# EAGLE design untitled (EAGLE 9.6.1)
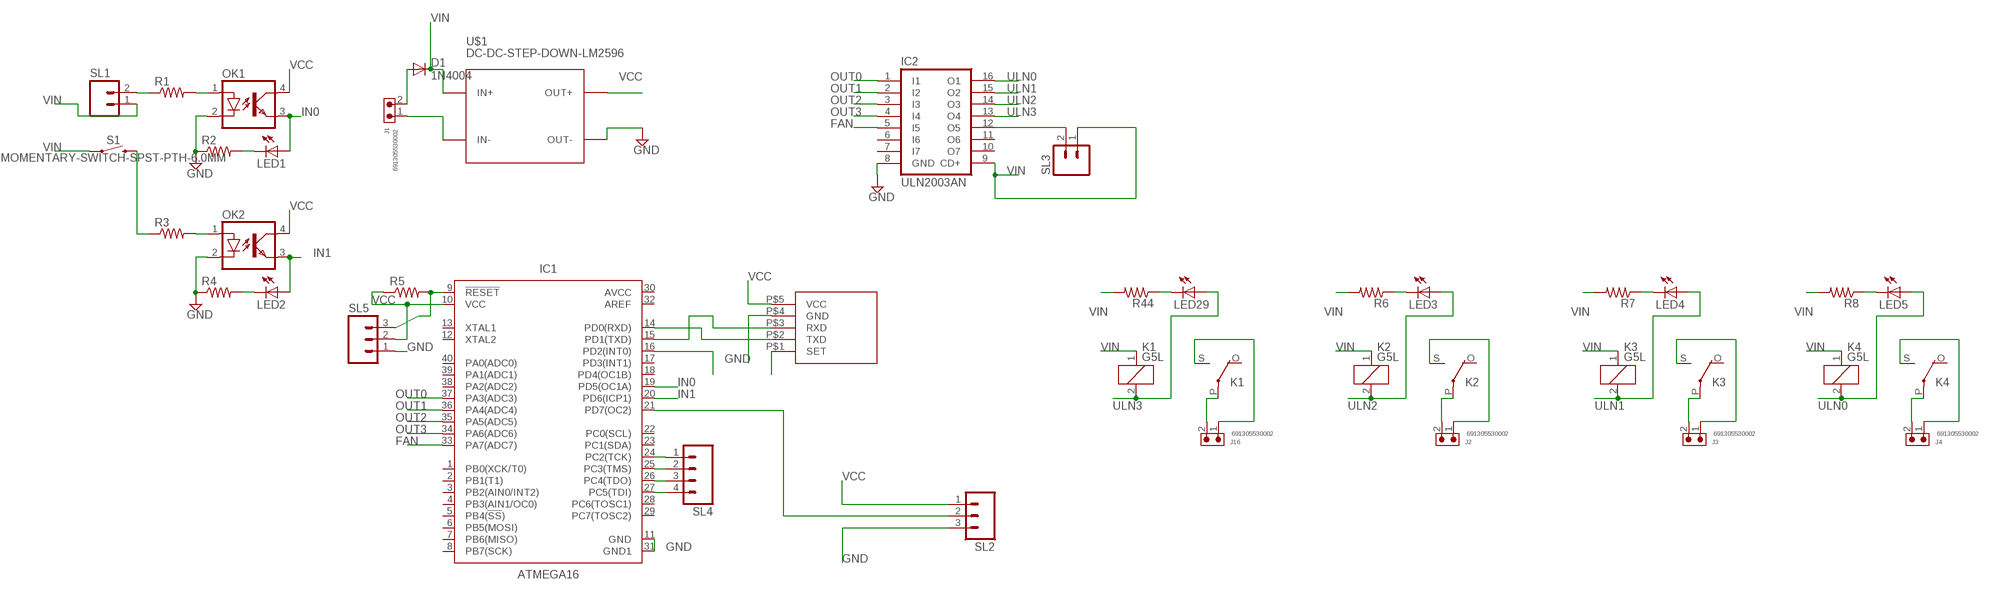
[diagram p0: schematic, sheet 1]

## Parts
D1  1N4004  [DO41-10]
IC1  ATMEGA16  ATMEGA32-16PU_DIP  [DIP1587W56P254L5229H482Q40B]
IC2  ULN2003AN  [DIL16]
J1  691305530002  691305530002  [691305530002]
J2  691305530002  691305530002  [691305530002]
J3  691305530002  691305530002  [691305530002]
J4  691305530002  691305530002  [691305530002]
J16  691305530002  691305530002  [691305530002]
K1  G5L  [G5LE]
K2  G5L  [G5LE]
K3  G5L  [G5LE]
K4  G5L  [G5LE]
LED1  LED5MM  [LED5MM]
LED2  LED5MM  [LED5MM]
LED3  LED5MM  [LED5MM]
LED4  LED5MM  [LED5MM]
LED5  LED5MM  [LED5MM]
LED29  LED5MM  [LED5MM]
OK1  PC817  [DIL04]
OK2  PC817  [DIL04]
R1  R-US_0207/7  [0207/7]
R2  R-US_0207/7  [0207/7]
R3  R-US_0207/7  [0207/7]
R4  R-US_0207/7  [0207/7]
R5  R-US_0207/7  [0207/7]
R6  R-US_0207/7  [0207/7]
R7  R-US_0207/7  [0207/7]
R8  R-US_0207/7  [0207/7]
R44  R-US_0207/7  [0207/7]
S1  MOMENTARY-SWITCH-SPST-PTH-6.0MM  [TACTILE_SWITCH_PTH_6.0MM]
SL1  M02  [02P]
SL2  M03  [03P]
SL3  M02  [02P]
SL4  M04  [04P]
SL5  M03  [03P]
U$1  DC-DC-STEP-DOWN-LM2596  [DC-DC-STEP-DOWN-LM2596]
U$2  HC12  [HC12]

## Nets
FAN: IC1.33(PA7(ADC7)) IC2.5(I5)
GND: IC1.11(GND) IC1.31(GND1) IC2.8(GND) OK1.2(C) OK2.2(C) R2.1 R4.1 SL2.3 SL5.1 U$1.OUT- U$2.P$4(GND)
IN0: IC1.19(PD5(OC1A)) LED1.A OK1.3(EMIT)
IN1: IC1.20(PD6(ICP1)) LED2.A OK2.3(EMIT)
N$1: D1.A J1.2
N$2: R1.1 SL1.2
N$3: OK1.1(A) R1.2
N$4: J2.2 K2.P(2:P)
N$5: IC1.9(!RESET!) R5.2 SL5.3
N$6: LED1.K(C) R2.2
N$7: R3.1 S1.3
N$8: OK2.1(A) R3.2
N$9: J2.1 K2.S(2:S)
N$10: LED3.K(C) R6.1
N$11: LED2.K(C) R4.2
N$12: J3.2 K3.P(2:P)
N$13: J3.1 K3.S(2:S)
N$14: LED4.K(C) R7.1
N$15: J4.2 K4.P(2:P)
N$16: J4.1 K4.S(2:S)
N$17: LED5.K(C) R8.1
N$18: IC1.14(PD0(RXD)) U$2.P$2(TXD)
N$19: IC1.15(PD1(TXD)) U$2.P$3(RXD)
N$20: IC1.16(PD2(INT0))
N$21: IC1.21(PD7(OC2)) SL2.2
N$22: IC2.12(O5) SL3.2
N$23: IC1.24(PC2(TCK)) SL4.1
N$24: J1.1 U$1.IN-
N$25: IC1.25(PC3(TMS)) SL4.2
N$26: IC1.26(PC4(TDO)) SL4.3
N$27: IC1.27(PC5(TDI)) SL4.4
N$28: U$2.P$1(SET)
N$75: J16.2 K1.P(2:P)
N$76: J16.1 K1.S(2:S)
N$77: LED29.K(C) R44.1
OUT0: IC1.37(PA3(ADC3)) IC2.1(I1)
OUT1: IC1.36(PA4(ADC4)) IC2.2(I2)
OUT2: IC1.35(PA5(ADC5)) IC2.3(I3)
OUT3: IC1.34(PA6(ADC6)) IC2.4(I4)
ULN0: IC2.16(O1) K4.2 LED5.A
ULN1: IC2.15(O2) K3.2 LED4.A
ULN2: IC2.14(O3) K2.2 LED3.A
ULN3: IC2.13(O4) K1.2 LED29.A
VCC: IC1.10(VCC) OK1.4(COL) OK2.4(COL) R5.1 SL2.1 SL5.2 U$1.OUT+ U$2.P$5(VCC)
VIN: D1.C IC2.9(CD+) K1.1 K2.1 K3.1 K4.1 R6.2 R7.2 R8.2 R44.2 S1.1 SL1.1 SL3.1 U$1.IN+
Unconnected: IC1.1(PB0(XCK/T0)) IC1.2(PB1(T1)) IC1.3(PB2(AIN0/INT2)) IC1.4(PB3(AIN1/OC0)) IC1.5(PB4(!SS!)) IC1.6(PB5(MOSI)) IC1.7(PB6(MISO)) IC1.8(PB7(SCK)) IC1.12(XTAL2) IC1.13(XTAL1) IC1.17(PD3(INT1)) IC1.18(PD4(OC1B)) IC1.22(PC0(SCL)) IC1.23(PC1(SDA)) IC1.28(PC6(TOSC1)) IC1.29(PC7(TOSC2)) IC1.32(AREF) IC1.38(PA2(ADC2)) IC1.39(PA1(ADC1)) IC1.40(PA0(ADC0)) IC2.6(I6) IC2.7(I7) IC2.10(O7) IC2.11(O6) K1.O(2:O) K2.O(2:O) K3.O(2:O) K4.O(2:O)

## Power pins joined to a net without a drawn wire
AVCC: IC1.30(AVCC)

## Library data of the parts
D1 = adafruit:1N4004: DIODE General purpose 1N400x type rectifier (With bigger pads) http://www.ladyada.net/library/pcb/eaglelibrary.html
IC1 = IC_Embedded:ATMEGA32*DIP: 8-bit Microcontroller with 32KBytes In-System Programmable Flash Datasheet <http://ww1.microchip.com/downloads/en/DeviceDoc/doc2503.pdf>; CATEGORY: IC_Embedded; DESCRIPTION: IC MCU 8BIT 32KB FLASH 40DIP; MANUFACTURER: Microchip Technology; MPN: ATMEGA32-16PU; OPERATING_TEMP: -40°C to 85°C; PART_STATUS: Active; SERIES: AVR® ATmega; SPEED: 16MHz; SUB-CATEGORY: Microcontroller
IC2 = uln-udn:ULN2003A: DRIVER ARRAY
J1-J4 J16 = Wurth_Connectors_WR-TBL Pluggable Connector:691305530002: WR-TBL Serie 3055 - 5,08 mm - PCB Header Vertical Entry with Plastic Latches KIND PROPERTIES Pitch 5.08 mm MATERIAL PROPERTIES Insulator Material PA66 Insulator Flammability Rating UL94 V-0 Insulator Color Green Terminal Material Copper Alloy Terminal Plating Tin-plated surface GENERAL INFORMATION Operating Temperature -40 up to +105 °C ELECTRICAL PROPERTIES IR UL 16 A Working Voltage [UL] 300 V (AC) Withstanding Voltage [UL] 2500 V (AC) Contact Resistance [UL] 20 mΩ CERTIFICATION UL Approval E315414 <https://www.we-online.com/catalog/media/o135349v209%20Family_WR-TBL3_6913055300xx.jpg> Details see: https://www.we-online.com/catalog/en/TBL_5_08_3055_6913055300XX/ Updated by Ella Wu 2019-12-30 2019(C) Wurth Elektronik; DATASHEET-URL: https://www.we-online.com/catalog/datasheet/691305530002.pdf; IR-UL: 16A; MOUNT: THT; PART-NUMBER: 691305530002; PINS: 2; PITCH: 5.08mm; TYPE: Vertical; WORKING-VOLTAGE-UL: 300V (AC)
K1-K4 = relay:G5L: RELAY 1 x switch, 10 A/120 V AC, 8 A/30 V ADC, Omron; OC_FARNELL: unknown; OC_NEWARK: unknown
LED1-LED5 LED29 = adafruit:LED: LED OSRAM: - CHIPLED LG R971, LG N971, LY N971, LG Q971, LY Q971, LO R971, LY R971 LH N974, LH R974 LS Q976, LO Q976, LY Q976 LO Q996 - Hyper CHIPLED LW Q18S LB Q993, LB Q99A, LB R99A - SideLED LS A670, LO A670, LY A670, LG A670, LP A670 LB A673, LV A673, LT A673, LW A673 LH A674 LY A675 LS A676, LA A676, LO A676, LY A676, LW A676 LS A679, LY A679, LG A679 - Hyper Micro SIDELED® LS Y876, LA Y876, LO Y876, LY Y876 LT Y87S - SmartLED LW L88C, LW L88S LB L89C, LB L89S, LG L890 LS L89K, LO L89K, LY L89K LS L896, LA L896, LO L896, LY L896 - TOPLED LS T670, LO T670, LY T670, LG T670, LP T670 LSG T670, LSP T670, LSY T670, LOP T670, LYG T670 LG T671, LOG T671, LSG T671 LB T673, LV T673, LT T673, LW T673 LH T674 LS T676, LA T676, LO T676, LY T676, LB T676, LH T676, LSB T676, LW T676 LB T67C, LV T67C, LT T67C, LS T67K, LO T67K, LY T67K, LW E67C LS E67B, LA E67B, LO E67B, LY E67B, LB E67C, LV E67C, LT E67C LW T67C LS T679, LY T679, LG T679 LS T770, LO T770, LY T770, LG T770, LP T770 LB T773, LV T773, LT T773, LW T773 LH T774 LS E675, LA E675, LY E675, LS T675 LS T776, LA T776, LO T776, LY T776, LB T776 LHGB T686 LT T68C, LB T68C - Hyper Mini TOPLED® LB M676 - Mini TOPLED Santana® LG M470 LS M47K, LO M47K, LY M47K Source: http://www.osram.convergy.de/
OK1 OK2 = optocoupler:PC817: SHARP OPTO COUPLER; MPN: PC817X4J000F; OC_FARNELL: 9707727; OC_NEWARK: 97K7059
R1-R8 R44 = adafruit:R-US_: RESISTOR, American symbol
S1 = SparkFun-Switches:MOMENTARY-SWITCH-SPST: Momentary Switch (Pushbutton) - SPST Normally-open (NO) SPST momentary switches (buttons, pushbuttons). Variants PTH-12MM - 12mm square, through-hole Momentary Pushbutton Switch - 12mm Square <https://www.sparkfun.com/products/9190> (COM-09190) PTH-6.0MM, PTH-6.0MM-KIT - 6.0mm square, through-hole Mini Pushbutton Switch <https://www.sparkfun.com/products/97> (COM-00097) KIT package intended for soldering kit's - only one side of pads' copper is exposed. PTH-RIGHT-ANGLE-KIT - Right-angle, through-hole Right Angle Tactile Button <https://www.sparkfun.com/products/10791> - Used on SparkFun BigTime Watch Kit <https://www.sparkfun.com/products/11734> SMD-12MM - 12mm square, surface-mount Tactile Button - SMD (12mm) <https://www.sparkfun.com/products/12993> (COM-12993) Used on SparkFun PicoBoard <https://www.sparkfun.com/products/11888> SMD-4.5MM - 4.5mm Square Trackball Switch Used on SparkFun Blackberry Trackballer Breakout <https://www.sparkfun.com/products/13169> SMD-4.6MMX2.8MM - 4.60mm x 2.80mm, surface mount Used on SparkFun SAMD21 Mini Breakout <https://www.sparkfun.com/products/13664> SMD-5.2MM, SMD-5.2-REDUNDANT - 5.2mm square, surface-mount Mini Pushbutton Switch - SMD <https://www.sparkfun.com/products/8720> (COM-08720) Used on Arduino Pro Mini <https://www.sparkfun.com/products/11114> REDUNDANT package connects both switch circuits together SMD-6.0X3.5MM - 6.0 x 3.5mm, surface mount Momentary Reset Switch SMD <https://www.sparkfun.com/products/8229> (COM-08229) SMD-6.2MM-TALL - 6.2mm square, surface mount Tactile Button - SMD (6mm) <https://www.sparkfun.com/products/12992> Used on SparkFun Digital Sandbox <https://www.sparkfun.com/products/12651> SMD-RIGHT-ANGLE - Right-angle, surface mount Used on SparkFun Block for Intel® Edison - Arduino <https://www.sparkfun.com/products/13036>; PROD_ID: SWCH-08441; SF_SKU: COM-00097
SL1 SL3 = con-amp-quick:M02: AMP QUICK CONNECTOR; OC_FARNELL: unknown; OC_NEWARK: unknown
SL2 SL5 = con-amp-quick:M03: AMP QUICK CONNECTOR; OC_FARNELL: unknown; OC_NEWARK: unknown
SL4 = con-amp-quick:M04: AMP QUICK CONNECTOR; OC_FARNELL: unknown; OC_NEWARK: unknown
U$1 = diy-modules:DC-DC-STEP-DOWN-LM2596: DC/DC Step-Down Regulator based on LM2596-ADJ chip LM2596 datasheet available here: http://www.ti.com/lit/ds/symlink/lm2596.pdf Click here to find device on ebay.com <http://www.ebay.com/sch/lm2596+power+regulator>
U$2 = techart:HC12

## Board
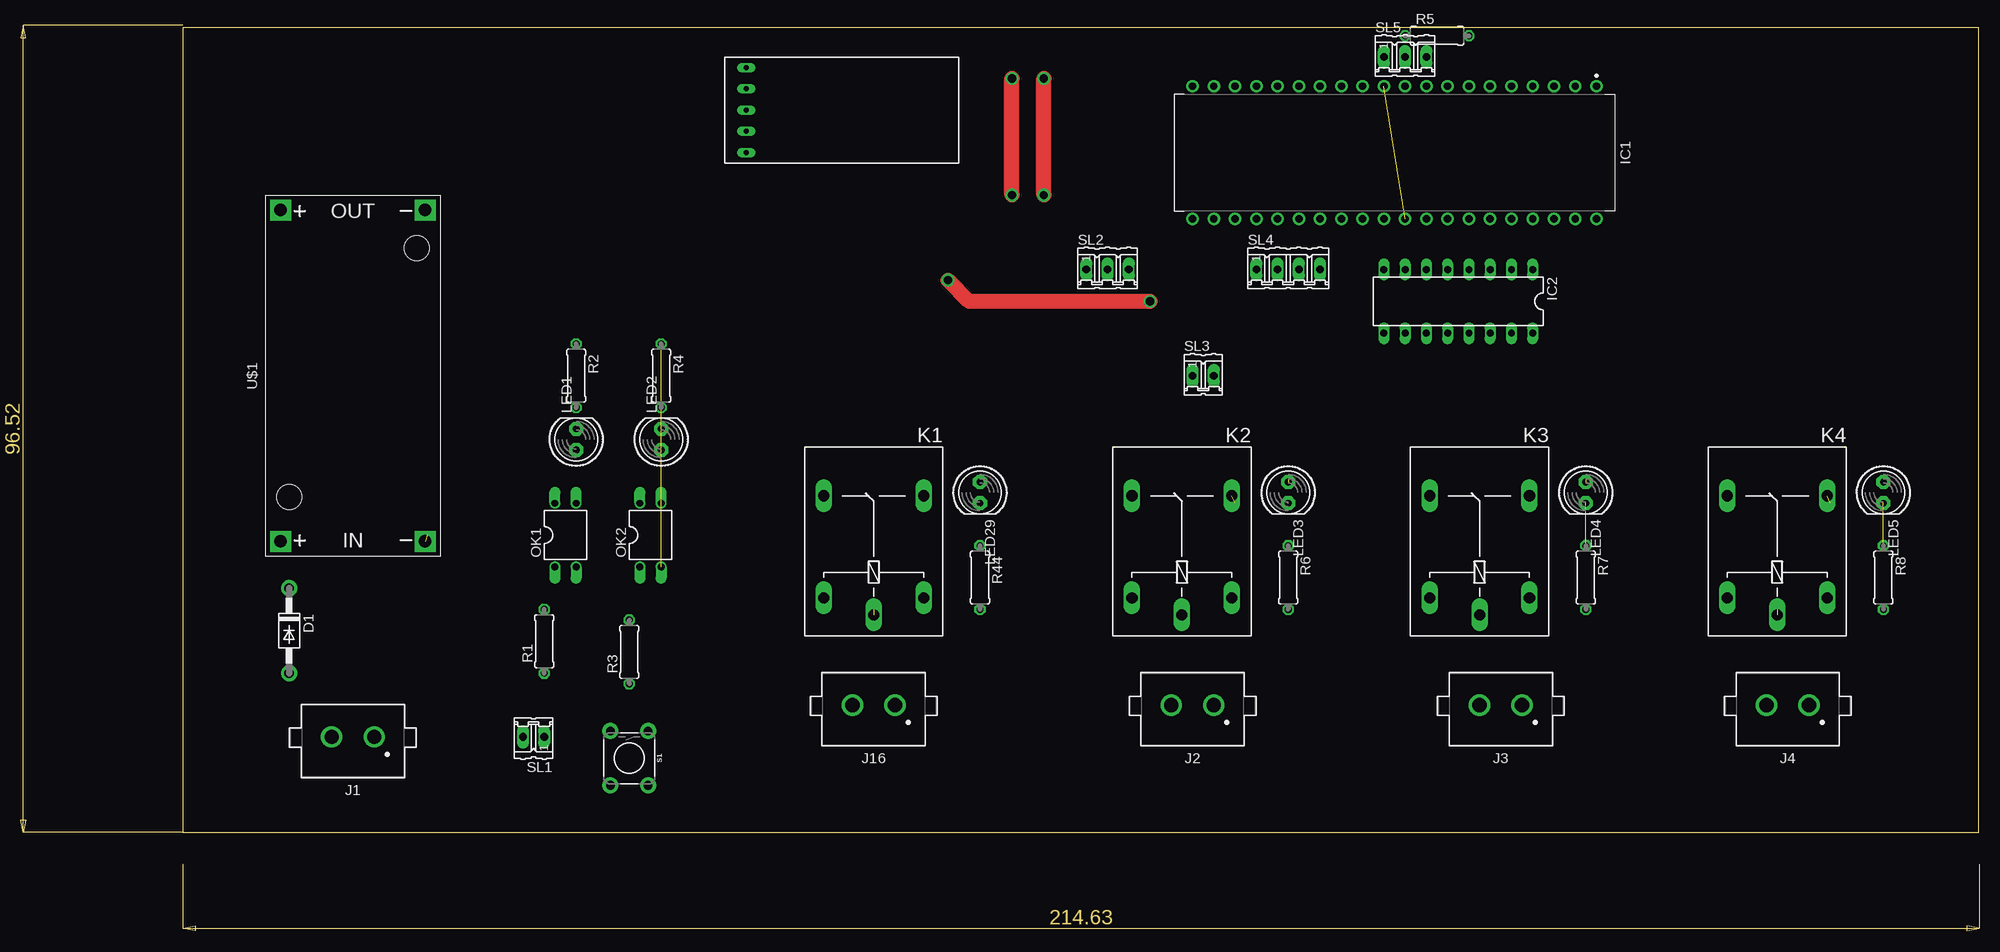
[diagram p1: board, top side]
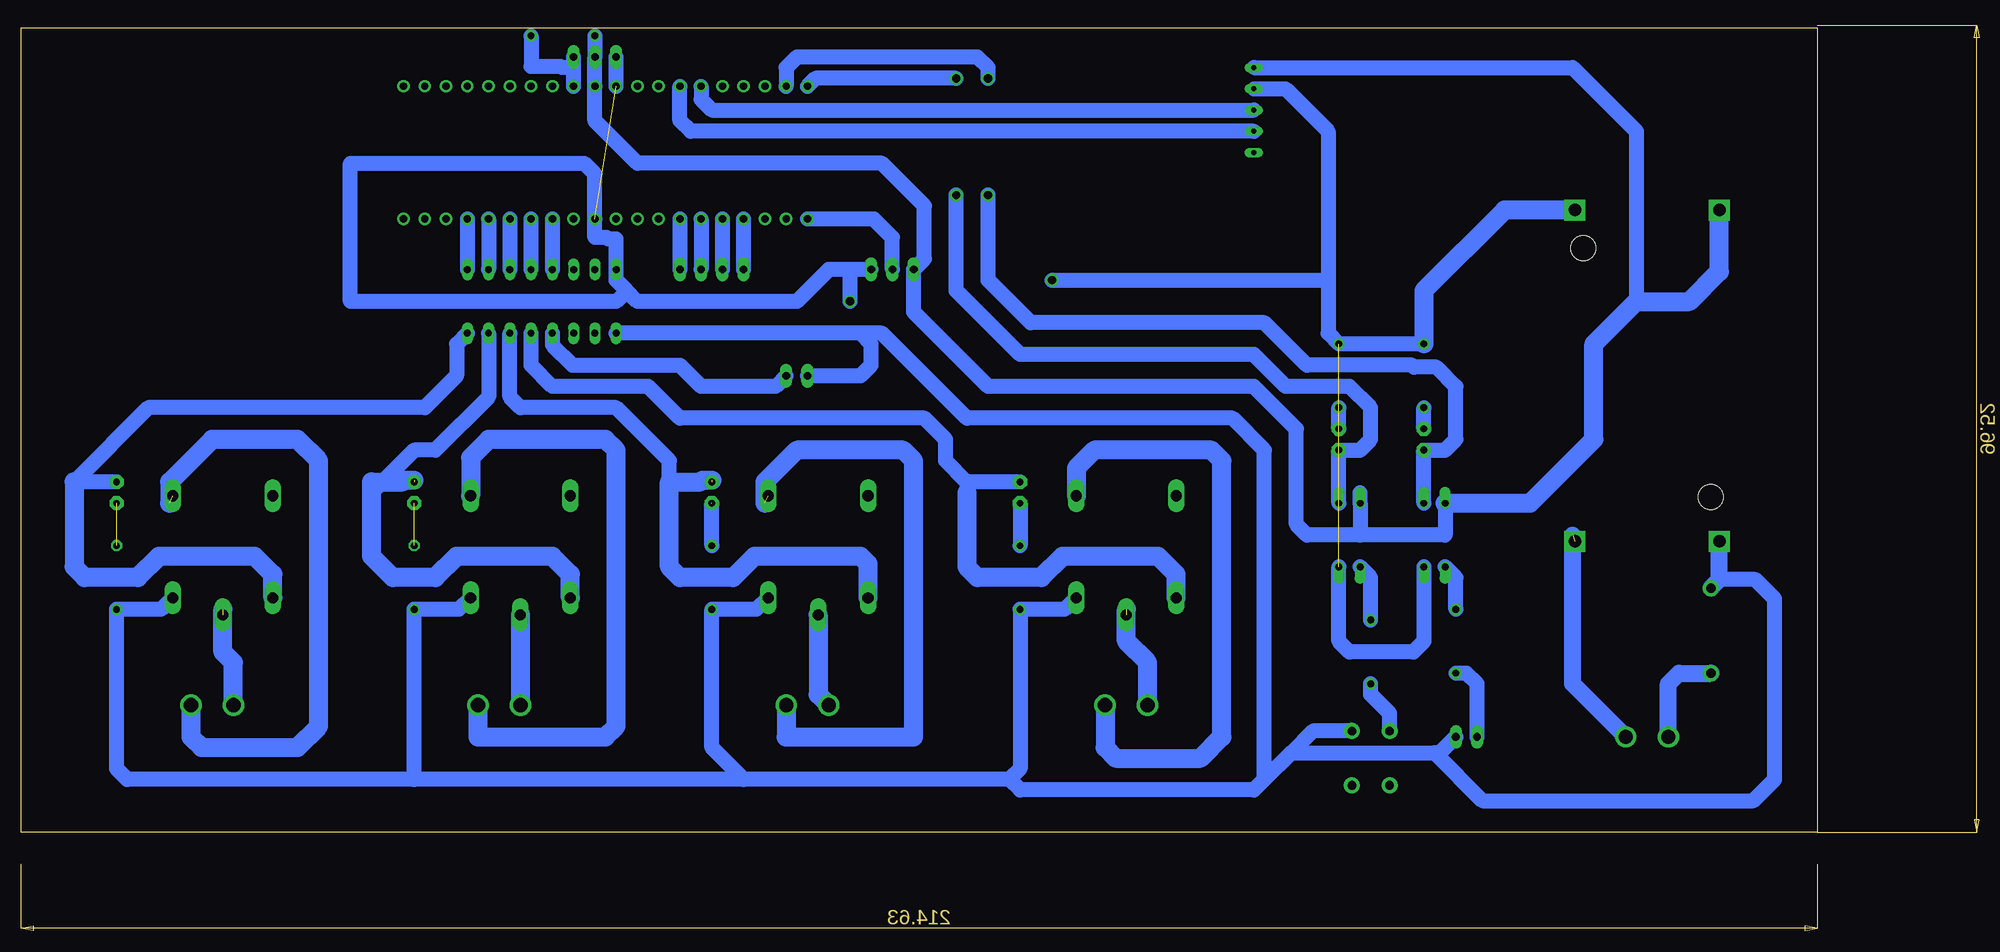
[diagram p2: board, bottom side, seen from below]

Size 214.61 x 96.19 mm. Coordinates in mm from the lower left corner, seen from the top.
Outline: 0,0 214.61,0 214.61,96.19 0,96.19 0,0
Copper layers (1*16): Top 0.035mm / dielectric 1.5mm / Bottom 0.035mm
Design rules "default *": minimum track width 30mil, minimum drill 0.35mm, track to track 30mil, track to pad 30mil, pad to pad 30mil, via to via 30mil, smd to smd 6mil, copper to edge 40mil, drill to drill 6mil, minimum pad ring 10mil, minimum via ring 8mil, stop-mask expansion 4mil, vias tented up to drill 0mil, thermal gap 10mil

### Footprints (pad centres in the part's own frame; a part is rotated, then mirrored left to right if it is on the bottom)
DO41-10 = drill 1.118 pad 1.93: A 5.08,0; C -5.08,0
DIP1587W56P254L5229H482Q40B = drill 0.877 pad 1.477: 1 -7.938,24.13; 2 -7.938,21.59; 3 -7.938,19.05; 4 -7.938,16.51; 5 -7.938,13.97; 6 -7.938,11.43; 7 -7.938,8.89; 8 -7.938,6.35; 9 -7.938,3.81; 10 -7.938,1.27; 11 -7.938,-1.27; 12 -7.938,-3.81; 13 -7.938,-6.35; 14 -7.938,-8.89; 15 -7.938,-11.43; 16 -7.938,-13.97; 17 -7.938,-16.51; 18 -7.938,-19.05; 19 -7.938,-21.59; 20 -7.938,-24.13; 21 7.938,-24.13; 22 7.938,-21.59; 23 7.938,-19.05; 24 7.938,-16.51; 25 7.938,-13.97; 26 7.938,-11.43; 27 7.938,-8.89; 28 7.938,-6.35; 29 7.938,-3.81; 30 7.938,-1.27; 31 7.938,1.27; 32 7.938,3.81; 33 7.938,6.35; 34 7.938,8.89; 35 7.938,11.43; 36 7.938,13.97; 37 7.938,16.51; 38 7.938,19.05; 39 7.938,21.59; 40 7.938,24.13
DIL16 = drill 0.813 long: 1 -8.89,-3.81; 2 -6.35,-3.81; 3 -3.81,-3.81; 4 -1.27,-3.81; 5 1.27,-3.81; 6 3.81,-3.81; 7 6.35,-3.81; 8 8.89,-3.81; 9 8.89,3.81; 10 6.35,3.81; 11 3.81,3.81; 12 1.27,3.81; 13 -1.27,3.81; 14 -3.81,3.81; 15 -6.35,3.81; 16 -8.89,3.81
691305530002 = drill 1.7: 1 -2.54,0; 2 2.54,0
G5LE = drill 1.321 long: 1 -7.493,-5.969; 2 -7.493,5.969; O 4.699,5.969; P -9.525,0; S 4.699,-5.969
LED5MM = drill 0.813 pad 1.676 octagon: A -1.27,0; K 1.27,0
DIL04 = drill 0.813 offset: 1 -1.27,-3.81; 2 1.27,-3.81; 3 1.27,3.81; 4 -1.27,3.81
0207/7 = drill 0.813 octagon: 1 -3.81,0; 2 3.81,0
TACTILE_SWITCH_PTH_6.0MM = drill 1.016 pad 1.88: 1 -3.251,2.261; 2 3.251,2.261; 3 -3.251,-2.261; 4 3.251,-2.261
02P = drill 0.914 long: 1 -1.27,0; 2 1.27,0
03P = drill 0.914 long: 1 -2.54,0; 2 0,0; 3 2.54,0
04P = drill 0.914 long: 1 -3.81,0; 2 -1.27,0; 3 1.27,0; 4 3.81,0
DC-DC-STEP-DOWN-LM2596 = drill 1.5 pad 2.5 square: IN+ -19.812,8.636; IN- -19.812,-8.636; OUT+ 19.812,8.636; OUT- 19.812,-8.636 | hole 3: -14.478,7.62; 15.24,-7.62
HC12 = drill 0.6 long: P$1 5.08,5.08; P$2 5.08,2.54; P$3 5.08,0; P$4 5.08,-2.54; P$5 5.08,-5.08

### Placement (x,y rotation side)
D1  12.7,24.13 270 top
IC1  144.78,81.28 270 top
IC2  152.4,63.5 180 top
J1  20.32,11.43 180 top
J2  120.65,15.24 180 top
J3  157.48,15.24 180 top
J4  191.77,15.24 180 top
J16  82.55,15.24 180 top
K1  82.55,35.56 90 top
K2  119.38,35.56 90 top
K3  154.94,35.56 90 top
K4  190.5,35.56 90 top
LED1  46.99,46.99 90 top
LED2  57.15,46.99 90 top
LED3  132.08,40.64 270 top
LED4  167.64,40.64 270 top
LED5  203.2,40.64 270 top
LED29  95.25,40.64 270 top
OK1  45.72,35.56 0 top
OK2  55.88,35.56 0 top
R1  43.18,22.86 90 top
R2  46.99,54.61 270 top
R3  53.34,21.59 90 top
R4  57.15,54.61 270 top
R5  149.86,95.25 0 top
R6  132.08,30.48 270 top
R7  167.64,30.48 270 top
R8  203.2,30.48 270 top
R44  95.25,30.48 270 top
S1  53.34,8.89 270 top
SL1  41.91,11.43 180 top
SL2  110.49,67.31 0 top
SL3  121.92,54.61 0 top
SL4  132.08,67.31 0 top
SL5  146.05,92.71 0 top
U$1  20.32,54.61 90 top
U$2  72.39,86.36 180 top

### Tracks (layer width: path | path; a pad name or v marks a point on that pad's centre or on a via)
FAN
  Bottom 1.778: IC1.33 IC2.5
GND  (via drill 1)  (2 unrouted)
  Top 1.778: v115.57,63.5 93.98,63.5 v91.44,66.04
  Bottom 1.778: OK1.2 46.99,22.86 48.26,21.59 55.88,21.59 57.15,22.86 OK2.2 | R2.1 R4.1 58.42,59.69 58.42,66.04 | IC1.11 SL5.1 | SL2.3 115.57,67.31 | 115.57,67.31 118.11,67.31 121.92,63.5 140.97,63.5 142.24,64.77 | 142.24,64.77 143.51,66.04 IC2.8 143.51,70.95 144.5,70.95 144.67,71.12 146.05,71.12 IC1.31 146.05,78.74 147.32,80.01 175.26,80.01 175.26,63.5 143.51,63.5 142.24,64.77 | U$2.P$4 63.5,88.9 58.42,83.82 58.42,66.04 | 115.57,67.31 v115.57,63.5 | v91.44,66.04 58.42,66.04
  Bottom 2.286: U$1.OUT- 37.34,74.42 46.99,64.77 R2.1
IN0  (via drill 1)
  Top 1.778: v99.06,76.2 v99.06,90.17
  Bottom 1.778: OK1.3 LED1.A 44.45,45.72 43.18,46.99 43.18,53.34 45.47,55.63 48.15,55.63 48.4,55.88 60.96,55.88 66.04,60.96 93.98,60.96 99.06,66.04 v99.06,76.2 | v99.06,90.17 99.06,91.44 100.33,92.71 121.92,92.71 123.19,91.44 IC1.19
IN1  (via drill 1)
  Top 1.778: v102.87,76.2 v102.87,90.17
  Bottom 1.778: OK2.3 LED2.A 54.61,45.72 53.34,46.99 53.34,50.8 55.88,53.34 63.5,53.34 67.31,57.15 95.25,57.15 102.87,64.77 v102.87,76.2 | v102.87,90.17 119.7,90.17 IC1.20
N$1
  Bottom 2.032: J1.2 17.78,17.78 16.51,19.05 D1.A
N$2
  Bottom 1.778: SL1.2 40.64,17.78 41.91,19.05 R1.1
N$3
  Bottom 1.778: R1.2 43.18,30.48 OK1.1
N$4
  Bottom 2.286: K2.P 119.38,16.51 J2.2
N$5
  Bottom 1.778: IC1.9 148.59,91.44 | 148.59,91.44 SL5.3 | 148.59,91.44 149.97,91.44 150.14,91.61 153.67,91.61 R5.2
N$6
  Bottom 1.778: LED1.K R2.2
N$7
  Bottom 1.778: S1.3 51.08,14.25 53.34,16.51 R3.1
N$8
  Bottom 1.778: R3.2 53.34,30.48 OK2.1
N$9  (1 unrouted)
  Bottom 2.286: J2.1 123.19,11.43 107.95,11.43 107.95,44.45 109.22,45.72 121.92,45.72 125.73,41.91 125.73,39.37
N$10  (1 unrouted)
  Bottom 1.778: R6.1 132.08,39.3 132.06,39.32
N$11
  Bottom 1.778: LED2.K R4.2
N$12
  Bottom 2.286: K3.P J3.2
N$13
  Bottom 2.286: J3.1 160.02,11.43 144.78,11.43 143.51,12.7 143.51,45.72 144.78,46.99 158.75,46.99 160.91,44.83 K3.S
N$14  (1 unrouted)
N$15  (1 unrouted)
  Bottom 2.286: J4.2 189.23,20.32 190.5,21.59 190.5,26.67
N$16  (1 unrouted)
  Bottom 2.286: J4.1 194.31,11.43 193.04,10.16 181.61,10.16 179.07,12.7 179.07,44.45 181.61,46.99 191.77,46.99 196.85,41.91 196.85,39.37
N$17  (1 unrouted)
N$18
  Bottom 1.778: U$2.P$2 134.62,83.82 135.89,85.09 IC1.14
N$19
  Bottom 1.778: IC1.15 133.35,87.63 132.08,86.36 U$2.P$3
N$21
  Bottom 1.778: SL2.2 110.49,71.12 112.71,73.34 IC1.21
N$22
  Bottom 1.778: IC2.12 151.13,58.3 148.71,55.88 135.89,55.88 133.35,53.34 124.46,53.34 SL3.2
N$23
  Bottom 1.778: SL4.1 IC1.24
N$24  (1 unrouted)
  Bottom 2.032: J1.1 29.21,17.78 29.21,35.56
N$25
  Bottom 1.778: IC1.25 SL4.2
N$26
  Bottom 1.778: IC1.26 SL4.3
N$27
  Bottom 1.778: IC1.27 SL4.4
N$75  (1 unrouted)
  Bottom 2.286: J16.2 80.01,20.32 82.55,22.86 82.55,26.67
N$76
  Bottom 2.286: J16.1 85.09,10.16 83.82,8.89 73.66,8.89 71.12,11.43 71.12,44.45 72.39,45.72 86.36,45.72 88.52,43.56 K1.S
N$77
  Bottom 1.778: LED29.K R44.1
OUT0
  Bottom 1.778: IC1.37 IC2.1
OUT1
  Bottom 1.778: IC1.36 IC2.2
OUT2
  Bottom 1.778: IC1.35 IC2.3
OUT3
  Bottom 1.778: IC2.4 IC1.34
ULN0
  Bottom 1.778: LED5.A 208.28,41.91 199.39,50.8 166.37,50.8 162.56,54.61 162.56,58.42 IC2.16
  Bottom 2.286: K4.2 184.53,30.86 186.69,33.02 198.12,33.02 200.66,30.48 207.01,30.48 208.28,31.75 208.28,41.91
ULN1  (1 unrouted)
  Bottom 1.778: IC2.15 158.75,52.07 165.1,45.72 167.64,45.72 172.72,40.64
  Bottom 2.286: K3.2 148.97,30.86 151.13,33.02 162.56,33.02 165.1,30.48 170.18,30.48 172.72,33.02 172.72,40.64 172.72,41.91 168.98,41.91 168.78,42.11 167.64,42.11
ULN2  (1 unrouted)
  Bottom 1.778: 137.16,41.91 137.16,44.45 143.51,50.8 154.94,50.8 156.21,52.07 IC2.14
  Bottom 2.286: K2.2 113.41,32.13 114.3,33.02 127,33.02 129.54,30.48 135.89,30.48 137.16,31.75 137.16,41.91 133.42,41.91 133.22,42.11 132.08,42.11
ULN3
  Bottom 1.778: LED29.A 101.6,41.91 | 101.6,41.91 101.6,40.64 | IC2.13 153.67,55.88 151.13,53.34 139.7,53.34 135.89,49.53 106.68,49.53 104.14,46.99 104.14,44.45 101.6,41.91
  Bottom 2.286: K1.2 76.58,30.86 78.74,33.02 90.17,33.02 92.71,30.48 100.33,30.48 101.6,31.75 101.6,40.64
VCC
  Bottom 1.778: OK1.4 44.45,35.56 54.61,35.56 | 54.61,35.56 OK2.4 54.61,40.64 | 54.61,35.56 60.96,35.56 62.23,36.83 62.23,48.26 67.31,53.34 99.06,53.34 107.95,62.23 SL2.1 106.68,68.58 106.68,74.93 111.76,80.01 140.97,80.01 146.05,85.09 IC1.10 SL5.2 R5.1 | 21.59,63.5 21.59,83.82 29.21,91.44 U$2.P$5
  Bottom 2.286: OK1.4 34.29,39.37 26.67,46.99 26.67,58.42 21.59,63.5 15.24,63.5 11.68,67.06 U$1.OUT+
VIN
  Bottom 1.778: K1.1 89.92,26.67 R44.2 95.25,7.62 96.52,6.35 | K2.1 126.75,26.67 R6.2 132.08,10.16 128.27,6.35 | K3.1 162.31,26.67 R7.2 167.64,6.35 | K4.1 197.87,26.67 R8.2 203.2,7.62 201.93,6.35 167.64,6.35 | 96.52,6.35 128.27,6.35 | 128.27,6.35 167.64,6.35 | S1.1 60.25,12.14 62.87,9.53 | 96.52,6.35 95.25,5.08 67.31,5.08 66.04,6.35 | 62.87,9.53 66.04,6.35 | 62.87,9.53 45.72,9.53 | 45.72,9.53 45.09,9.53 SL1.1 | 66.04,6.35 66.04,45.72 69.85,49.53 101.6,49.53 111.76,59.69 114.3,59.69 | 114.3,59.69 IC2.9 | SL3.1 114.3,54.61 113.03,55.88 113.03,58.42 114.3,59.69 | 45.72,9.53 40.01,3.81 7.62,3.81 5.08,6.35 5.08,27.94 7.37,30.23 11.68,30.23
  Bottom 2.032: D1.C 11.68,30.23 U$1.IN+